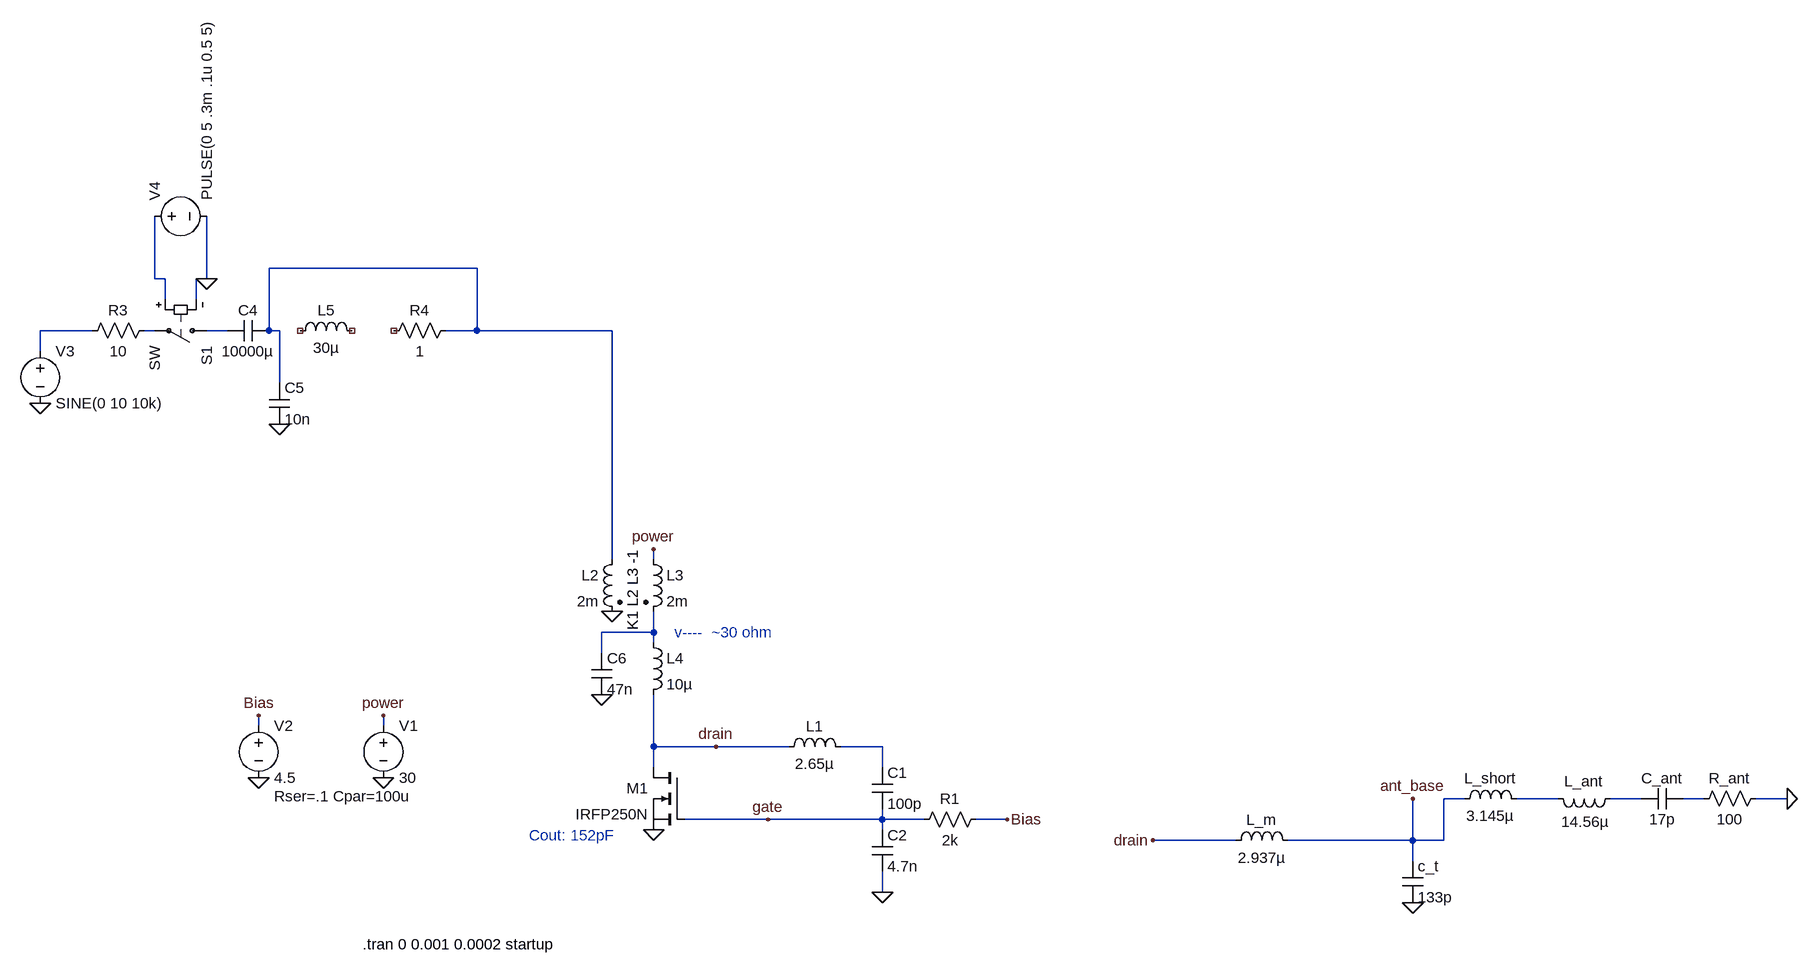
[diagram p0: schematic AMhz10-radio-transformer_choke.asc]
AMhz10-radio-transformer_choke.asc, the LTspice schematic file:
Version 4
SHEET 1 2004 680
WIRE -32 -720 -352 -720
WIRE -528 -704 -528 -800
WIRE -512 -704 -528 -704
WIRE -448 -704 -448 -800
WIRE -448 -704 -464 -704
WIRE -512 -672 -512 -704
WIRE -464 -672 -464 -704
WIRE -624 -624 -704 -624
WIRE -528 -624 -544 -624
WIRE -416 -624 -448 -624
WIRE -352 -624 -352 -720
WIRE -336 -624 -352 -624
WIRE -32 -624 -32 -720
WIRE -32 -624 -80 -624
WIRE 176 -624 -32 -624
WIRE -704 -592 -704 -624
WIRE -336 -544 -336 -624
WIRE 176 -272 176 -624
WIRE 240 -272 240 -288
WIRE 240 -160 240 -192
WIRE 240 -160 160 -160
WIRE 240 -144 240 -160
WIRE 160 -128 160 -160
WIRE -368 -16 -368 -32
WIRE -176 -16 -176 -32
WIRE 240 16 240 -64
WIRE 336 16 240 16
WIRE 448 16 336 16
WIRE 592 16 528 16
WIRE 240 48 240 16
WIRE 592 48 592 16
WIRE 1488 96 1456 96
WIRE 1632 96 1568 96
WIRE 1760 96 1712 96
WIRE 1856 96 1824 96
WIRE 1984 96 1936 96
WIRE 416 128 288 128
WIRE 592 128 592 112
WIRE 592 128 416 128
WIRE 656 128 592 128
WIRE 784 128 736 128
WIRE 592 144 592 128
WIRE 1136 160 1008 160
WIRE 1408 160 1408 96
WIRE 1408 160 1216 160
WIRE 1456 160 1456 96
WIRE 1456 160 1408 160
WIRE 1408 192 1408 160
WIRE 592 240 592 208
FLAG -176 -32 power
FLAG 240 -288 power
FLAG 240 144 0
FLAG 592 240 0
FLAG -176 64 0
FLAG -368 -32 Bias
FLAG -368 64 0
FLAG 784 128 Bias
FLAG 1984 96 0
FLAG 416 128 gate
FLAG -704 -512 0
FLAG -336 -480 0
FLAG 1408 96 ant_base
FLAG 1408 256 0
FLAG 336 16 drain
FLAG 1008 160 drain
FLAG -448 -704 0
FLAG 176 -192 0
FLAG 160 -64 0
SYMBOL nmos 288 48 M0
SYMATTR InstName M1
SYMATTR Value IRFP250N
SYMBOL ind 432 32 R270
WINDOW 0 32 56 VTop 2
WINDOW 3 5 56 VBottom 2
SYMATTR InstName L1
SYMATTR Value 2.65µ
SYMBOL cap 576 48 R0
SYMATTR InstName C1
SYMATTR Value 100p
SYMBOL voltage -176 -32 R0
WINDOW 123 0 0 Left 0
WINDOW 39 0 0 Left 0
SYMATTR InstName V1
SYMATTR Value 30
SYMBOL voltage -368 -32 R0
WINDOW 123 0 0 Left 0
WINDOW 39 24 124 Left 2
SYMATTR SpiceLine Rser=.1 Cpar=100u
SYMATTR InstName V2
SYMATTR Value 4.5
SYMBOL cap 576 144 R0
SYMATTR InstName C2
SYMATTR Value 4.7n
SYMATTR SpiceLine Rser=.01
SYMBOL res 752 112 R90
WINDOW 0 0 56 VBottom 2
WINDOW 3 32 56 VTop 2
SYMATTR InstName R1
SYMATTR Value 2k
SYMBOL cap 1824 80 R90
WINDOW 0 0 32 VBottom 2
WINDOW 3 32 32 VTop 2
SYMATTR InstName C_ant
SYMATTR Value 17p
SYMBOL res 1840 112 R270
WINDOW 0 32 56 VTop 2
WINDOW 3 0 56 VBottom 2
SYMATTR InstName R_ant
SYMATTR Value 100
SYMBOL ind 1728 80 R90
WINDOW 0 5 56 VBottom 2
WINDOW 3 36 54 VTop 2
SYMATTR InstName L_ant
SYMATTR Value 14.56µ
SYMBOL cap -352 -640 R90
WINDOW 0 0 32 VBottom 2
WINDOW 3 32 32 VTop 2
SYMATTR InstName C4
SYMATTR Value 10000µ
SYMBOL ind -320 -608 R270
WINDOW 0 32 56 VTop 2
WINDOW 3 5 56 VBottom 2
SYMATTR InstName L5
SYMATTR Value 30µ
SYMATTR SpiceLine Rser=100
SYMBOL res -528 -640 R90
WINDOW 0 0 56 VBottom 2
WINDOW 3 32 56 VTop 2
SYMATTR InstName R3
SYMATTR Value 10
SYMBOL voltage -704 -608 R0
WINDOW 123 0 0 Left 0
WINDOW 39 0 0 Left 0
SYMATTR InstName V3
SYMATTR Value SINE(0 10 10k)
SYMBOL cap -352 -544 R0
SYMATTR InstName C5
SYMATTR Value 10n
SYMBOL sw -432 -624 R90
SYMATTR InstName S1
SYMBOL voltage -544 -800 R270
WINDOW 123 0 0 Left 0
WINDOW 39 0 0 Left 0
SYMATTR InstName V4
SYMATTR Value PULSE(0 5 .3m .1u 0.5 5)
SYMBOL cap 1392 192 R0
SYMATTR InstName c_t
SYMATTR Value 133p
SYMBOL ind 1120 176 R270
WINDOW 0 32 56 VTop 2
WINDOW 3 5 56 VBottom 2
SYMATTR InstName L_m
SYMATTR Value 2.937µ
SYMBOL res -64 -640 R90
WINDOW 0 0 56 VBottom 2
WINDOW 3 32 56 VTop 2
SYMATTR InstName R4
SYMATTR Value 1
SYMBOL ind 1472 112 R270
WINDOW 0 32 56 VTop 2
WINDOW 3 5 56 VBottom 2
SYMATTR InstName L_short
SYMATTR Value 3.145µ
SYMBOL ind2 224 -288 R0
SYMATTR InstName L3
SYMATTR Value 2m
SYMBOL ind2 192 -288 M0
SYMATTR InstName L2
SYMATTR Value 2m
SYMBOL ind 224 -160 R0
SYMATTR InstName L4
SYMATTR Value 10µ
SYMBOL cap 144 -128 R0
SYMATTR InstName C6
SYMATTR Value 47n
TEXT -208 320 Left 2 !.tran 0 0.001 0.0002 startup
TEXT 48 152 Left 2 ;Cout: 152pF
TEXT 208 -288 VRight 2 !K1 L2 L3 -1
TEXT 272 -160 Left 2 ;v----  ~30 ohm

The netlist it stands for:
* AMhz10-radio-transformer_choke.asc
M1 drain gate 0 0 IRFP250N
L1 drain N007 2.65µ
C1 N007 gate 100p
V1 power 0 30
V2 Bias 0 4.5 Rser=.1 Cpar=100u
C2 gate 0 4.7n Rser=.01
R1 Bias gate 2k
C_ant N010 N009 17p
R_ant N010 0 100
L_ant N009 N008 14.56µ
C4 N001 N005 10000µ
L5 NC_01 NC_02 30µ Rser=100
R3 N004 N003 10
V3 N003 0 SINE(0 10 10k)
C5 N001 0 10n
S1 N005 N004 N002 0 SW
V4 N002 0 PULSE(0 5 .3m .1u 0.5 5)
c_t ant_base 0 133p
L_m drain ant_base 2.937µ
R4 N001 NC_03 1
L_short ant_base N008 3.145µ
L3 power N006 2m
L2 N001 0 2m
L4 N006 drain 10µ
C6 N006 0 47n
.model NMOS NMOS
.model PMOS PMOS
.lib standard.mos
.tran 0 0.001 0.0002 startup
* Cout: 152pF
K1 L2 L3 -1
* v----  ~30 ohm
.backanno
.end